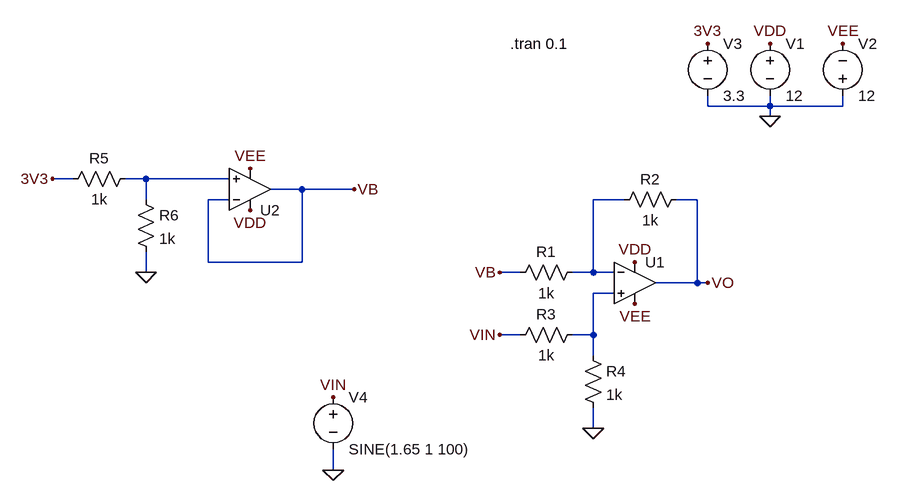
[diagram p0: schematic DAC-amplifier.asc]
DAC-amplifier.asc, the LTspice schematic file:
Version 4
SHEET 1 880 680
WIRE 160 64 160 48
WIRE 256 64 256 48
WIRE 256 64 160 64
WIRE 368 64 368 48
WIRE 368 64 256 64
WIRE 256 80 256 64
WIRE -816 176 -848 176
WIRE -704 176 -736 176
WIRE -576 176 -704 176
WIRE -464 192 -512 192
WIRE -384 192 -464 192
WIRE -704 208 -704 176
WIRE -576 208 -608 208
WIRE 32 208 -16 208
WIRE 144 208 112 208
WIRE -608 304 -608 208
WIRE -464 304 -464 192
WIRE -464 304 -608 304
WIRE -704 320 -704 288
WIRE -128 320 -160 320
WIRE -16 320 -16 208
WIRE -16 320 -48 320
WIRE 16 320 -16 320
WIRE 144 336 144 208
WIRE 144 336 80 336
WIRE 160 336 144 336
WIRE 16 352 -16 352
WIRE -128 416 -160 416
WIRE -16 416 -16 352
WIRE -16 416 -48 416
WIRE -16 448 -16 416
WIRE -16 560 -16 528
WIRE -416 624 -416 592
FLAG 256 80 0
FLAG 256 -32 VDD
FLAG 48 304 VDD
FLAG 368 -32 VEE
FLAG 48 368 VEE
FLAG -416 624 0
FLAG -416 512 VIN
FLAG -160 416 VIN
FLAG -16 560 0
FLAG 160 336 VO
FLAG -704 320 0
FLAG 160 -32 3V3
FLAG -848 176 3V3
FLAG -544 160 VEE
FLAG -544 224 VDD
FLAG -384 192 VB
FLAG -160 320 VB
SYMBOL OpAmps\\UniversalOpAmp 48 336 R0
SYMATTR InstName U1
SYMBOL voltage 256 -48 R0
SYMATTR InstName V1
SYMATTR Value 12
SYMBOL voltage 368 64 M180
WINDOW 0 24 96 Left 2
WINDOW 3 24 16 Left 2
SYMATTR InstName V2
SYMATTR Value 12
SYMBOL res -32 304 R90
WINDOW 0 0 56 VBottom 2
WINDOW 3 32 56 VTop 2
SYMATTR InstName R1
SYMATTR Value 1k
SYMBOL res 128 192 R90
WINDOW 0 0 56 VBottom 2
WINDOW 3 32 56 VTop 2
SYMATTR InstName R2
SYMATTR Value 1k
SYMBOL res -32 400 R90
WINDOW 0 0 56 VBottom 2
WINDOW 3 32 56 VTop 2
SYMATTR InstName R3
SYMATTR Value 1k
SYMBOL res -32 432 R0
SYMATTR InstName R4
SYMATTR Value 1k
SYMBOL voltage 160 -48 R0
WINDOW 123 0 0 Left 0
WINDOW 39 0 0 Left 0
SYMATTR InstName V3
SYMATTR Value 3.3
SYMBOL voltage -416 496 R0
WINDOW 123 0 0 Left 0
WINDOW 39 0 0 Left 0
SYMATTR InstName V4
SYMATTR Value SINE(1.65 1 100)
SYMBOL res -720 160 R90
WINDOW 0 0 56 VBottom 2
WINDOW 3 32 56 VTop 2
SYMATTR InstName R5
SYMATTR Value 1k
SYMBOL res -720 192 R0
SYMATTR InstName R6
SYMATTR Value 1k
SYMBOL OpAmps\\UniversalOpAmp -544 192 M180
SYMATTR InstName U2
TEXT -144 -32 Left 2 !.tran 0.1

The netlist it stands for:
* DAC-amplifier.asc
XU1 N003 N002 VDD VEE VO level1 Avol=1Meg GBW=10Meg Vos=0 En=0 Enk=0 In=0 Ink=0 Rin=500Meg  ; pins In+ In- V+ V- OUT
V1 VDD 0 12
V2 0 VEE 12
R1 N002 VB 1k
R2 VO N002 1k
R3 N003 VIN 1k
R4 N003 0 1k
V3 3V3 0 3.3
V4 VIN 0 SINE(1.65 1 100)
R5 N001 3V3 1k
R6 N001 0 1k
XU2 N001 VB VDD VEE VB level1 Avol=1Meg GBW=10Meg Vos=0 En=0 Enk=0 In=0 Ink=0 Rin=500Meg  ; pins In+ In- V+ V- OUT
.tran 0.1
.lib UniversalOpAmp1.lib
.backanno
.end